# Altium project Dice RGB.PrjPcb
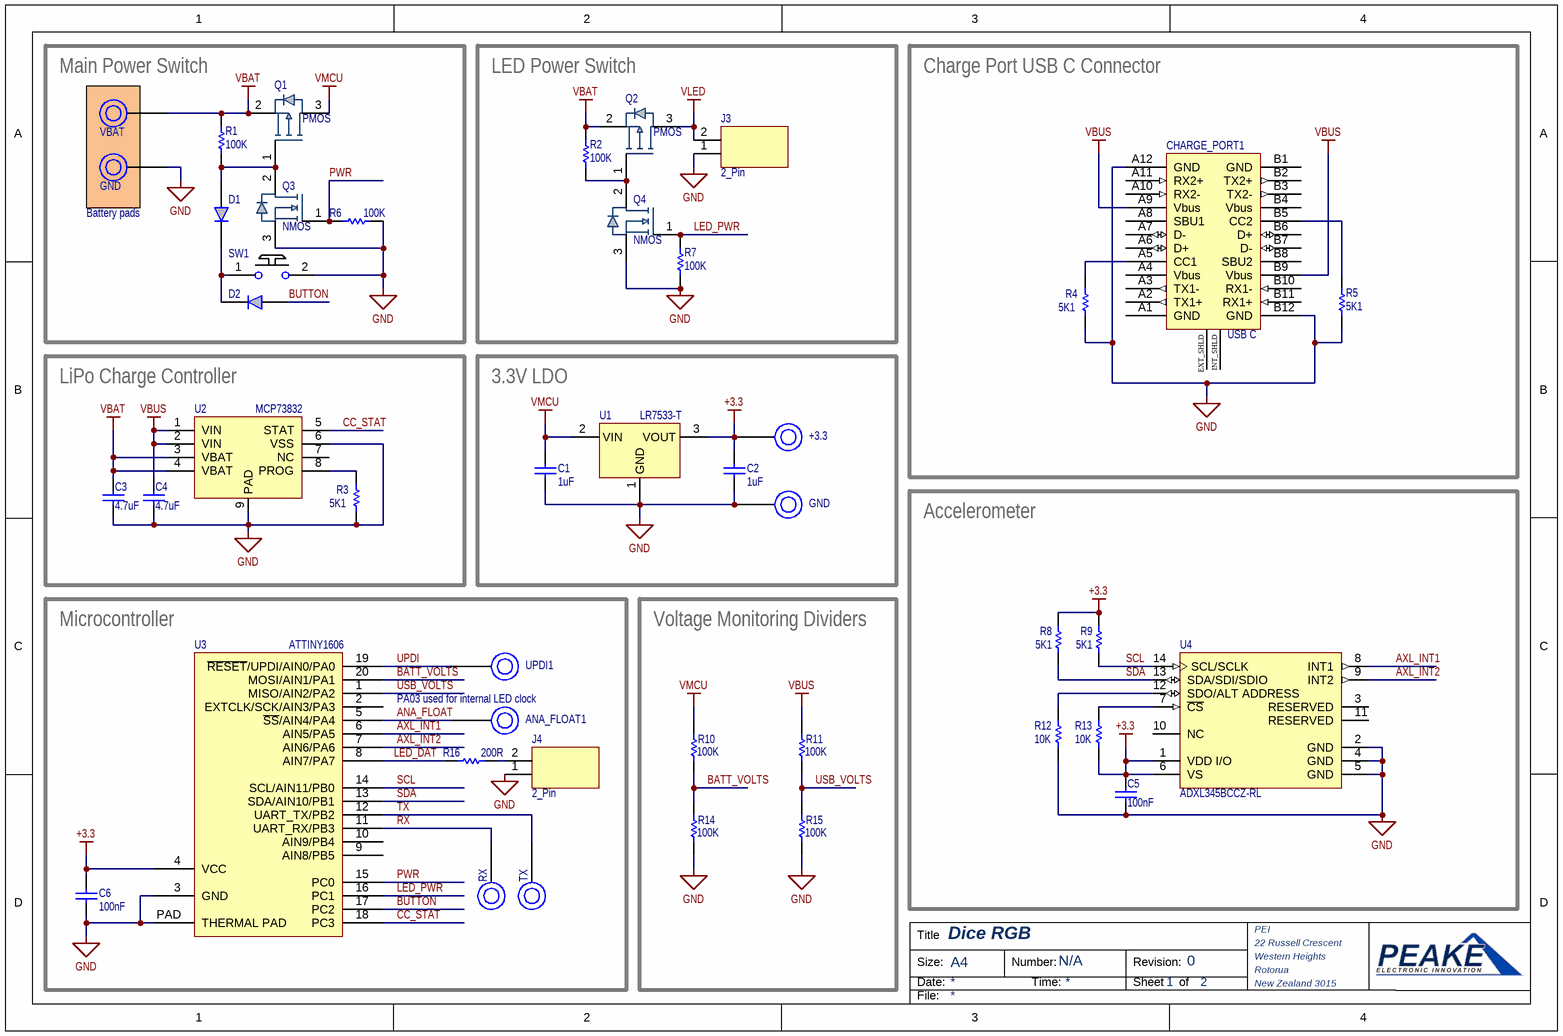
[diagram p0: Dice RGB - Sht 1.SchDoc]
2 sheets, 111 parts. Net scope: global (net labels, ports and power ports of the same name join across sheets).
Board file: Dice RGB.PcbDoc
Sheets:
  Dice RGB - Sht 1.SchDoc
  Dice RGB - Sht 2.SchDoc

## Sheet Dice RGB - Sht 1.SchDoc: Dice RGB
size A4; Organization: PEI; Address1: 22 Russell Crescent; Address2: Western Heights; Address3: Rotorua; Address4: New Zealand 3015; DocumentNumber: N/A; Revision: 0; SheetNumber: 1; SheetTotal: 2

### Parts
(Parts that share a designator on the sheet are numbered #1, #2 ... from top to bottom, then left to right.)
+3.3  Prog Pad  [Prog Pad 1mm]  (value not drawn)
ANA_FLOAT1  Prog Pad  [Prog Pad 1mm]  (value not drawn)
C1  value 1uF  [0603_CAP]  (hidden comment: Capacitor)
C2  value 1uF  [0603_CAP]  (hidden comment: Capacitor)
C3  value 4.7uF  [0603_CAP]  (hidden comment: Capacitor)
C4  value 4.7uF  [0603_CAP]  (hidden comment: Capacitor)
C5  value 100nF  [0603_CAP]  (hidden comment: Capacitor)
C6  value 100nF  [0603_CAP]  (hidden comment: Capacitor)
CHARGE_PORT1  USB C  [USB-TYPE-C-014]
D1  Diode  [SOD-523]  (value not drawn)
D2  Diode  [SOD-523]  (value not drawn)
GND#1  Prog Pad  [Prog Pad 1.5 x 2.5mm]  (value not drawn)
GND#2  Prog Pad  [Prog Pad 1mm]  (value not drawn)
J3  2_Pin  [2P 2mm PTH female header]
J4  2_Pin  [2P 2mm PTH female header]
Q1  PMOS  [SOT-23-PMOS]
Q2  PMOS  [SOT-23-PMOS]
Q3  NMOS  [SOT-23]
Q4  NMOS  [SOT-23]
R1  value 100K  [0603_RES]  (hidden comment: Resistor)
R2  value 100K  [0603_RES]  (hidden comment: Resistor)
R3  value 5K1  [0603_RES]  (hidden comment: Resistor)
R4  value 5K1  [0603_RES]  (hidden comment: Resistor)
R5  value 5K1  [0603_RES]  (hidden comment: Resistor)
R6  value 100K  [0603_RES]  (hidden comment: Resistor)
R7  value 100K  [0603_RES]  (hidden comment: Resistor)
R8  value 5K1  [0603_RES]  (hidden comment: Resistor)
R9  value 5K1  [0603_RES]  (hidden comment: Resistor)
R10  value 100K  [0603_RES]  (hidden comment: Resistor)
R11  value 100K  [0603_RES]  (hidden comment: Resistor)
R12  value 10K  [0603_RES]  (hidden comment: Resistor)
R13  value 10K  [0603_RES]  (hidden comment: Resistor)
R14  value 100K  [0603_RES]  (hidden comment: Resistor)
R15  value 100K  [0603_RES]  (hidden comment: Resistor)
R16  value 200R  [0603_RES]  (hidden comment: Resistor)
RX  Prog Pad  [Prog Pad 1mm]  (value not drawn)
SW1  Button  [PTS526 SK15 SMTR2 LFS SMD Tactile Push Button]  (value not drawn)
TX  Prog Pad  [Prog Pad 1mm]  (value not drawn)
U1  LR7533-T  [SOT-23]
U2  MCP73832  [8P 2x3 DFN]
U3  ATTINY1606  [20P 3x3 VQFN]
U4  ADXL345BCCZ-RL  [ADI-CC-14-1_V]
UPDI1  Prog Pad  [Prog Pad 1mm]  (value not drawn)
VBAT  Prog Pad  [Prog Pad 1.5 x 2.5mm]  (value not drawn)

### Blocks framed on the sheet
Main Power Switch: D1 D2 GND#1 Q1 Q3 R1 R6 SW1 VBAT
LED Power Switch: J3 Q2 Q4 R2 R7
Charge Port USB C Connector: CHARGE_PORT1 R4 R5
LiPo Charge Controller: C3 C4 R3 U2
3.3V LDO: +3.3 C1 C2 GND#2 U1
Accelerometer: C5 R8 R9 R12 R13 U4
Microcontroller: ANA_FLOAT1 C6 J4 R16 RX TX U3 UPDI1
Voltage Monitoring Dividers: R10 R11 R14 R15

### Nets
+3.3: +3.3.1 C2.2 C5.2 C6.2 R8.2 R9.2 R13.1 U1.3(VOUT) U3.4(VCC) U4.1(VDD_I/O) U4.6(VS)
GND: C1.1 C2.1 C3.1 C4.1 C5.1 C6.1 CHARGE_PORT1.A12(GND) CHARGE_PORT1.B12(GND) GND#1.1 GND#2.1 J3.1(GND) J4.1(GND) Q3.3(S) Q4.3(S) R3.1 R4.1 R5.1 R6.1 R7.1 R12.1 R14.1 R15.1 SW1.2 U1.1(GND) U2.6(VSS) U2.9(PAD) U3.3(GND) U3.PAD(THERMAL_PAD) U4.2(GND) U4.4(GND) U4.5(GND)
VBAT: C3.2 Q1.2(S) Q2.2(S) R1.2 R2.2 U2.3(VBAT) U2.4(VBAT) VBAT.1
VBUS: C4.2 CHARGE_PORT1.A9(Vbus) CHARGE_PORT1.B9(Vbus) R11.2 U2.1(VIN) U2.2(VIN)
VLED: J3.2(V+) Q2.3(D)
VMCU: C1.2 Q1.3(D) R10.2 U1.2(VIN)
ANA_FLOAT: ANA_FLOAT1.1 U3.5(~{SS}/AIN4/PA4)
AXL_INT1: U3.6(AIN5/PA5) U4.8(INT1)
AXL_INT2: U3.7(AIN6/PA6) U4.9(INT2)
BATT_VOLTS: R10.1 R14.2 U3.20(MOSI/AIN1/PA1)
BUTTON: D2.2(A) U3.17(PC2)
CC_STAT: U2.5(STAT) U3.18(PC3)
LED_DAT: R16.2 U3.8(AIN7/PA7)
LED_PWR: Q4.1(G) R7.2 U3.16(PC1)
PWR: Q3.1(G) R6.2 U3.15(PC0)
RX: RX.1 U3.11(UART_RX/PB3)
SCL: R9.1 U3.14(SCL/AIN11/PB0) U4.14(SCL/SCLK)
SDA: R8.1 U3.13(SDA/AIN10/PB1) U4.13(SDA/SDI/SDIO)
TX: TX.1 U3.12(UART_TX/PB2)
UPDI: U3.19(~{RESET}/UPDI/AIN0/PA0) UPDI1.1
USB_VOLTS: R11.1 R15.2 U3.1(MISO/AIN2/PA2)
NetCHARGE_PORT1_A5: CHARGE_PORT1.A5(CC1) R4.2
NetCHARGE_PORT1_B5: CHARGE_PORT1.B5(CC2) R5.2
NetD1_1: D1.1(K) D2.1(K) SW1.1
NetD1_2: D1.2(A) Q1.1(G) Q3.2(D) R1.1
NetJ4_2: J4.2(DAT) R16.1
NetQ2_1: Q2.1(G) Q4.2(D) R2.1
NetR3_2: R3.2 U2.8(PROG)
NetR12_2: R12.2 U4.12(SDO/ALT_ADDRESS)
NetR13_2: R13.2 U4.7(~{CS})

Not connected (* = marked no-connect by the designer): CHARGE_PORT1 A1(GND) A2(TX1+) A3(TX1-) A4(Vbus) A6(D+) A7(D-) A8(SBU1) A10(RX2-) A11(RX2+) B1(GND) B2(TX2+) B3(TX2-) B4(Vbus) B6(D+) B7(D-) B8(SBU2) B10(RX1-) B11(RX1+) EXT_SHLD INT_SHLD; U2 7(NC); U3 2(EXTCLK/SCK/AIN3/PA3) 9(AIN8/PB5) 10(AIN9/PB4); U4 3(RESERVED) 10(NC) 11(RESERVED)

### Notes on the sheet
- Battery pads
- (near ANA_FLOAT1) PA03 used for internal LED clock
- Title
- Size:
- Date:
- A4
- Number:
- Time:
- Revision:
- Sheet
- of
- File:

### Library data of the parts
+3.3 ANA_FLOAT1 GND#1 GND#2 RX TX UPDI1 VBAT = CMP-00044-1: Programmer pogo-pin interface pad (or test pad)
C1-C6 = CMP-001-00083-1: SMD Capacitor; Pins: 2; Source: Discrete.SchLib; Component Type: Standard; Design Item ID: Capacitor
CHARGE_PORT1 = CMP-00005-5: Vertical or RA Type C Usb Connector Rohs Compliant: Yes
D1 D2 = CMP-004-00031-3: SMD Diode; Design Item ID: Diode; Component Type: Standard; Source: Discrete.SchLib; Pins: 2
J3 J4 = CMP-002-00074-4: 2 Pin Connector; Source: Connectors.SchLib; Pins: 2; Component Type: Standard; Design Item ID: 2_Pin; MFN: *
Q1 Q2 = CMP-004-0033-1: P Channel MOSFET; MFN: BSS308PE; Source: P-MOS.SchLib; Component Type: Standard; Design Item ID: PMOS; Pin Count: 3
Q3 Q4 = CMP-004-0025-1: N Channel MOSFET; Pin Count: 3; Design Item ID: NMOS; Component Type: Standard; MFN: *; Source: N-MOS.SchLib
R1-R16 = CMP-009-00177-1: SMD Resistor; Component Type: Standard; Source: Discrete.SchLib; Design Item ID: Resistor; Pins: 2
SW1 = CMP-011-00013-4: Momentary push button; Design Item ID: Button; Pins: 2; Component Type: Standard; Source: Discrete.SchLib
U1 = CMP-00058-1: 55dB@1kHz 100mA 1.5uA -10℃~85℃ Fixed 3.3V~3.3V Positive 1 24V SOT-23-3 Linear Voltage Regulators (LDO) ROHS
U2 = CMP-00057-1: Battery Management Li-Ion/Li-Poly Charg Mgnt 4.2V Vreg out
U3 = CMP-00040-2: 8-bit AVR MCU, 16 KB, 1024 Bytes, 20 MHz, 1.8 to 5.5V, VQFN-20, RoHS; RoHS Compliant: Yes
U4 = CMP-010-00001-2: 3-Axis, +/-2 g / +/-4 g / +/-8 g / +/-16 g Digital Accelerometer with Digital Output, 1.6 KHz BW, -40 to 85 degC, 14-Pin LGA, Reel; Manufacturer: Analog Devices; Interface: Serial; Max Supply Voltage: 3.6V; Package Version: 03-16-2010-A, 03/2010; Min Supply Voltage: 2V; Nominal Supply Current: 140uA; Sensor Type: Motion; Nominal Supply Voltage: 2.5V; Package Quantity: 5000; Packaging: TapeandReel; Min Operating Temperature: -40°C; RoHS Compliant: True; Package Reference: CC-14-1; Max Operating Temperature: 85°C; Package Description: 14-Pin Land Grid Array, 3 x 5 mm Body, 0.8 mm Pitch; Datasheet URL: http://www.analog.com/static/imported-files/data_sheets/ADXL345.pdf; Pins: 14; Mounting Technology: SM; Case/Package: LGA; Datasheet Version: Rev. E, 06/2015

## Sheet Dice RGB - Sht 2.SchDoc: Dice RGB - LED panel
size A4; Organization: PEI; Address1: 22 Russell Crescent; Address2: Western Heights; Address3: Rotorua; Address4: New Zealand 3015; DocumentNumber: N/A; Revision: 0; SheetNumber: 2; SheetTotal: 2
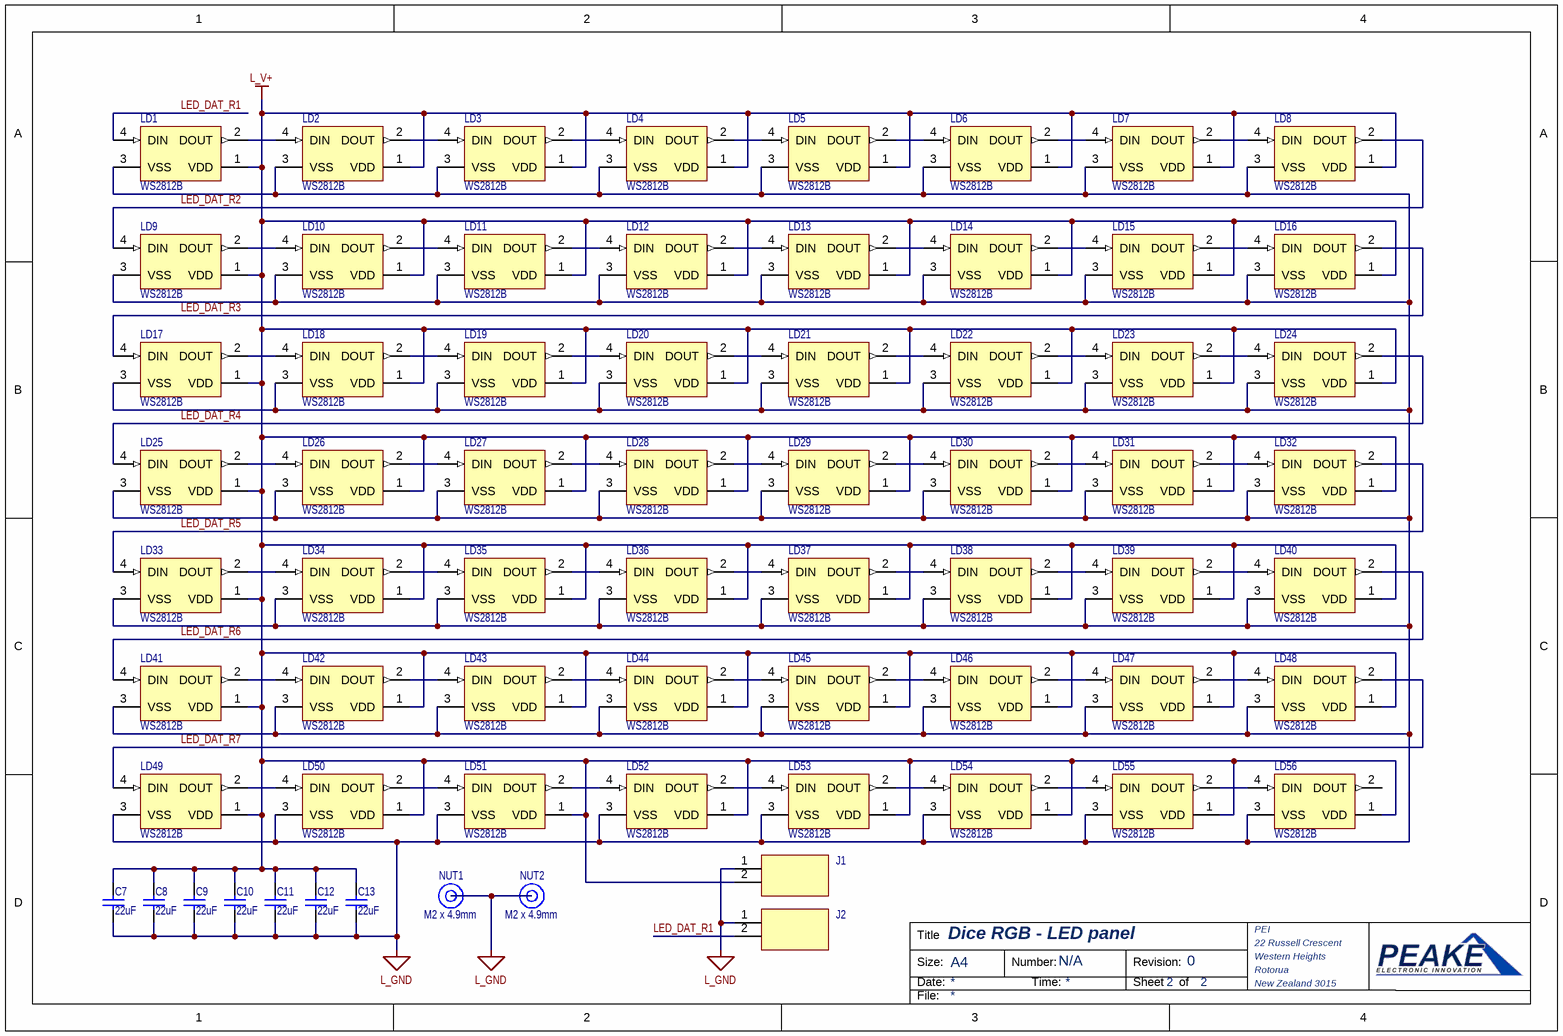
[diagram p1: Dice RGB - Sht 2.SchDoc]

### Parts
C7  value 22uF  [0805_CAP]  (hidden comment: Capacitor)
C8  value 22uF  [0805_CAP]  (hidden comment: Capacitor)
C9  value 22uF  [0805_CAP]  (hidden comment: Capacitor)
C10  value 22uF  [0805_CAP]  (hidden comment: Capacitor)
C11  value 22uF  [0805_CAP]  (hidden comment: Capacitor)
C12  value 22uF  [0805_CAP]  (hidden comment: Capacitor)
C13  value 22uF  [0805_CAP]  (hidden comment: Capacitor)
J1  2_Pin  [2P 2mm SMD dbl height male header]  (value not drawn)
J2  2_Pin  [2P 2mm SMD dbl height male header]  (value not drawn)
LD1  WS2812B  [WS2812B-2020]
LD2  WS2812B  [WS2812B-2020]
LD3  WS2812B  [WS2812B-2020]
LD4  WS2812B  [WS2812B-2020]
LD5  WS2812B  [WS2812B-2020]
LD6  WS2812B  [WS2812B-2020]
LD7  WS2812B  [WS2812B-2020]
LD8  WS2812B  [WS2812B-2020]
LD9  WS2812B  [WS2812B-2020]
LD10  WS2812B  [WS2812B-2020]
LD11  WS2812B  [WS2812B-2020]
LD12  WS2812B  [WS2812B-2020]
LD13  WS2812B  [WS2812B-2020]
LD14  WS2812B  [WS2812B-2020]
LD15  WS2812B  [WS2812B-2020]
LD16  WS2812B  [WS2812B-2020]
LD17  WS2812B  [WS2812B-2020]
LD18  WS2812B  [WS2812B-2020]
LD19  WS2812B  [WS2812B-2020]
LD20  WS2812B  [WS2812B-2020]
LD21  WS2812B  [WS2812B-2020]
LD22  WS2812B  [WS2812B-2020]
LD23  WS2812B  [WS2812B-2020]
LD24  WS2812B  [WS2812B-2020]
LD25  WS2812B  [WS2812B-2020]
LD26  WS2812B  [WS2812B-2020]
LD27  WS2812B  [WS2812B-2020]
LD28  WS2812B  [WS2812B-2020]
LD29  WS2812B  [WS2812B-2020]
LD30  WS2812B  [WS2812B-2020]
LD31  WS2812B  [WS2812B-2020]
LD32  WS2812B  [WS2812B-2020]
LD33  WS2812B  [WS2812B-2020]
LD34  WS2812B  [WS2812B-2020]
LD35  WS2812B  [WS2812B-2020]
LD36  WS2812B  [WS2812B-2020]
LD37  WS2812B  [WS2812B-2020]
LD38  WS2812B  [WS2812B-2020]
LD39  WS2812B  [WS2812B-2020]
LD40  WS2812B  [WS2812B-2020]
LD41  WS2812B  [WS2812B-2020]
LD42  WS2812B  [WS2812B-2020]
LD43  WS2812B  [WS2812B-2020]
LD44  WS2812B  [WS2812B-2020]
LD45  WS2812B  [WS2812B-2020]
LD46  WS2812B  [WS2812B-2020]
LD47  WS2812B  [WS2812B-2020]
LD48  WS2812B  [WS2812B-2020]
LD49  WS2812B  [WS2812B-2020]
LD50  WS2812B  [WS2812B-2020]
LD51  WS2812B  [WS2812B-2020]
LD52  WS2812B  [WS2812B-2020]
LD53  WS2812B  [WS2812B-2020]
LD54  WS2812B  [WS2812B-2020]
LD55  WS2812B  [WS2812B-2020]
LD56  WS2812B  [WS2812B-2020]
NUT1  M2 x 4.9mm  [PCB Nut M2-SMD]
NUT2  M2 x 4.9mm  [PCB Nut M2-SMD]

### Nets
L_GND: C7.1 C8.1 C9.1 C10.1 C11.1 C12.1 C13.1 J1.1(GND) J2.1(GND) LD1.3(VSS) LD2.3(VSS) LD3.3(VSS) LD4.3(VSS) LD5.3(VSS) LD6.3(VSS) LD7.3(VSS) LD8.3(VSS) LD9.3(VSS) LD10.3(VSS) LD11.3(VSS) LD12.3(VSS) LD13.3(VSS) LD14.3(VSS) LD15.3(VSS) LD16.3(VSS) LD17.3(VSS) LD18.3(VSS) LD19.3(VSS) LD20.3(VSS) LD21.3(VSS) LD22.3(VSS) LD23.3(VSS) LD24.3(VSS) LD25.3(VSS) LD26.3(VSS) LD27.3(VSS) LD28.3(VSS) LD29.3(VSS) LD30.3(VSS) LD31.3(VSS) LD32.3(VSS) LD33.3(VSS) LD34.3(VSS) LD35.3(VSS) LD36.3(VSS) LD37.3(VSS) LD38.3(VSS) LD39.3(VSS) LD40.3(VSS) LD41.3(VSS) LD42.3(VSS) LD43.3(VSS) LD44.3(VSS) LD45.3(VSS) LD46.3(VSS) LD47.3(VSS) LD48.3(VSS) LD49.3(VSS) LD50.3(VSS) LD51.3(VSS) LD52.3(VSS) LD53.3(VSS) LD54.3(VSS) LD55.3(VSS) LD56.3(VSS) NUT1.1 NUT2.1
L_V+: C7.2 C8.2 C9.2 C10.2 C11.2 C12.2 C13.2 J1.2(V+) LD1.1(VDD) LD2.1(VDD) LD3.1(VDD) LD4.1(VDD) LD5.1(VDD) LD6.1(VDD) LD7.1(VDD) LD8.1(VDD) LD9.1(VDD) LD10.1(VDD) LD11.1(VDD) LD12.1(VDD) LD13.1(VDD) LD14.1(VDD) LD15.1(VDD) LD16.1(VDD) LD17.1(VDD) LD18.1(VDD) LD19.1(VDD) LD20.1(VDD) LD21.1(VDD) LD22.1(VDD) LD23.1(VDD) LD24.1(VDD) LD25.1(VDD) LD26.1(VDD) LD27.1(VDD) LD28.1(VDD) LD29.1(VDD) LD30.1(VDD) LD31.1(VDD) LD32.1(VDD) LD33.1(VDD) LD34.1(VDD) LD35.1(VDD) LD36.1(VDD) LD37.1(VDD) LD38.1(VDD) LD39.1(VDD) LD40.1(VDD) LD41.1(VDD) LD42.1(VDD) LD43.1(VDD) LD44.1(VDD) LD45.1(VDD) LD46.1(VDD) LD47.1(VDD) LD48.1(VDD) LD49.1(VDD) LD50.1(VDD) LD51.1(VDD) LD52.1(VDD) LD53.1(VDD) LD54.1(VDD) LD55.1(VDD) LD56.1(VDD)
LED_DAT_R1: J2.2(DAT) LD1.4(DIN)
LED_DAT_R2: LD8.2(DOUT) LD9.4(DIN)
LED_DAT_R3: LD16.2(DOUT) LD17.4(DIN)
LED_DAT_R4: LD24.2(DOUT) LD25.4(DIN)
LED_DAT_R5: LD32.2(DOUT) LD33.4(DIN)
LED_DAT_R6: LD40.2(DOUT) LD41.4(DIN)
LED_DAT_R7: LD48.2(DOUT) LD49.4(DIN)
NetLD1_2: LD1.2(DOUT) LD2.4(DIN)
NetLD2_2: LD2.2(DOUT) LD3.4(DIN)
NetLD3_2: LD3.2(DOUT) LD4.4(DIN)
NetLD4_2: LD4.2(DOUT) LD5.4(DIN)
NetLD5_2: LD5.2(DOUT) LD6.4(DIN)
NetLD6_2: LD6.2(DOUT) LD7.4(DIN)
NetLD7_2: LD7.2(DOUT) LD8.4(DIN)
NetLD9_2: LD9.2(DOUT) LD10.4(DIN)
NetLD10_2: LD10.2(DOUT) LD11.4(DIN)
NetLD11_2: LD11.2(DOUT) LD12.4(DIN)
NetLD12_2: LD12.2(DOUT) LD13.4(DIN)
NetLD13_2: LD13.2(DOUT) LD14.4(DIN)
NetLD14_2: LD14.2(DOUT) LD15.4(DIN)
NetLD15_2: LD15.2(DOUT) LD16.4(DIN)
NetLD17_2: LD17.2(DOUT) LD18.4(DIN)
NetLD18_2: LD18.2(DOUT) LD19.4(DIN)
NetLD19_2: LD19.2(DOUT) LD20.4(DIN)
NetLD20_2: LD20.2(DOUT) LD21.4(DIN)
NetLD21_2: LD21.2(DOUT) LD22.4(DIN)
NetLD22_2: LD22.2(DOUT) LD23.4(DIN)
NetLD23_2: LD23.2(DOUT) LD24.4(DIN)
NetLD25_2: LD25.2(DOUT) LD26.4(DIN)
NetLD26_2: LD26.2(DOUT) LD27.4(DIN)
NetLD27_2: LD27.2(DOUT) LD28.4(DIN)
NetLD28_2: LD28.2(DOUT) LD29.4(DIN)
NetLD29_2: LD29.2(DOUT) LD30.4(DIN)
NetLD30_2: LD30.2(DOUT) LD31.4(DIN)
NetLD31_2: LD31.2(DOUT) LD32.4(DIN)
NetLD33_2: LD33.2(DOUT) LD34.4(DIN)
NetLD34_2: LD34.2(DOUT) LD35.4(DIN)
NetLD35_2: LD35.2(DOUT) LD36.4(DIN)
NetLD36_2: LD36.2(DOUT) LD37.4(DIN)
NetLD37_2: LD37.2(DOUT) LD38.4(DIN)
NetLD38_2: LD38.2(DOUT) LD39.4(DIN)
NetLD39_2: LD39.2(DOUT) LD40.4(DIN)
NetLD41_2: LD41.2(DOUT) LD42.4(DIN)
NetLD42_2: LD42.2(DOUT) LD43.4(DIN)
NetLD43_2: LD43.2(DOUT) LD44.4(DIN)
NetLD44_2: LD44.2(DOUT) LD45.4(DIN)
NetLD45_2: LD45.2(DOUT) LD46.4(DIN)
NetLD46_2: LD46.2(DOUT) LD47.4(DIN)
NetLD47_2: LD47.2(DOUT) LD48.4(DIN)
NetLD49_2: LD49.2(DOUT) LD50.4(DIN)
NetLD50_2: LD50.2(DOUT) LD51.4(DIN)
NetLD51_2: LD51.2(DOUT) LD52.4(DIN)
NetLD52_2: LD52.2(DOUT) LD53.4(DIN)
NetLD53_2: LD53.2(DOUT) LD54.4(DIN)
NetLD54_2: LD54.2(DOUT) LD55.4(DIN)
NetLD55_2: LD55.2(DOUT) LD56.4(DIN)

Not connected (* = marked no-connect by the designer): LD56 2(DOUT)

### Notes on the sheet
- Title
- Size:
- Date:
- A4
- Number:
- Time:
- Revision:
- Sheet
- of
- File:

### Library data of the parts
C7-C13 = CMP-001-00083-1: SMD Capacitor; Pins: 2; Source: Discrete.SchLib; Component Type: Standard; Design Item ID: Capacitor
J1 J2 = CMP-002-00074-4: 2 Pin Connector; Source: Connectors.SchLib; Pins: 2; Component Type: Standard; Design Item ID: 2_Pin; MFN: *
LD1-LD56 = CMP-007-00035-3: Intelligent Control LED Integrated Light Source, 3.5 to 5.3 V, -25 to 80 degC, 4-Pin SMD, RoHS, Bulk; Manufacturer: Adafruit Industries; Datasheet Version: May-13; Datasheet URL: https://cdn-shop.adafruit.com/datasheets/WS2812B.pdf; Manufacturer URL: https://www.adafruit.com/; Mounting Technology: SM; Case/Package: WS2812B; Package Description: 4-Pin Surface Mount Device, Body 5 x 5 mm, Pitch 3.3 mm; Package Reference: WS2812B; RoHS Compliant: False
NUT1 NUT2 = CMP-00059-1: SMD or through hole soldered PCB nut; Thread: M2 x 0.4; MFN: SMTWE2035MTJ; Length: 4.9mm; Mount style: SMD